# Altium schematic sheet Central PCB.SchDoc
size A
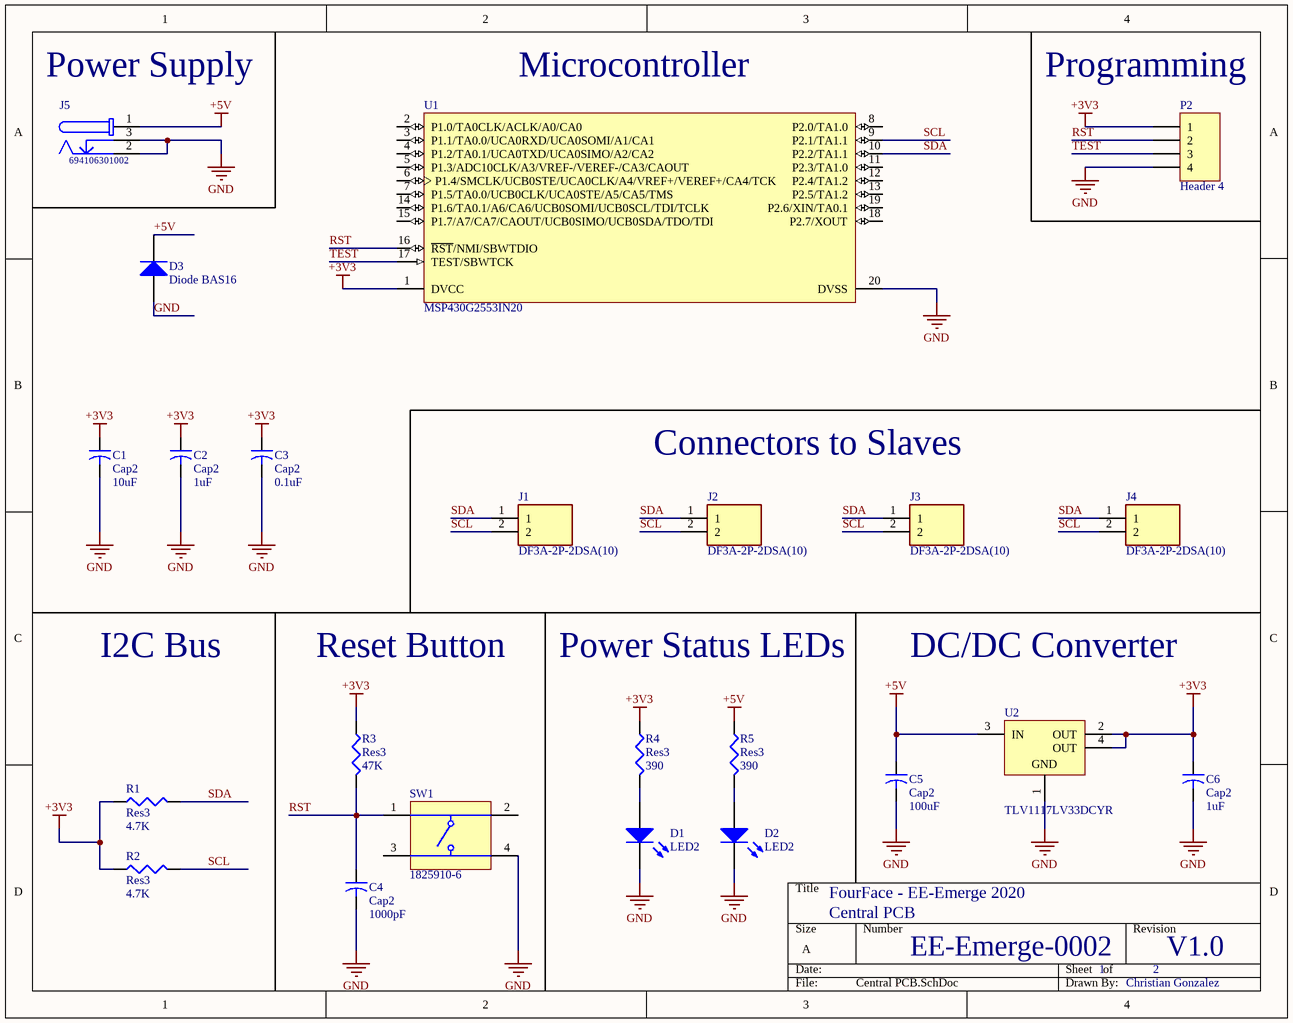
[diagram p0: Central PCB.SchDoc]

## Parts
C1  Cap2  value 10uF  [C0805]
C2  Cap2  value 1uF  [C0805]
C3  Cap2  value 0.1uF  [C0805]
C4  Cap2  value 1000pF  [C0805]
C5  Cap2  value 100uF  [C0805]
C6  Cap2  value 1uF  [C0805]
D1  LED2  [3.2X1.6X1.1]
D2  LED2  [3.2X1.6X1.1]
D3  Diode BAS16  [SOT-23_N]
J1  DF3A-2P-2DSA(10)  [SHDR2W50P0X200_1X2_600X500X500P]
J2  DF3A-2P-2DSA(10)  [SHDR2W50P0X200_1X2_600X500X500P]
J3  DF3A-2P-2DSA(10)  [SHDR2W50P0X200_1X2_600X500X500P]
J4  DF3A-2P-2DSA(10)  [SHDR2W50P0X200_1X2_600X500X500P]
J5  694106301002  [694106301002]
P2  Header 4  [HDR1X4]
R1  Res3  value 4.7K  [6-0805_N]
R2  Res3  value 4.7K  [6-0805_N]
R3  Res3  value 47K  [6-0805_N]
R4  Res3  value 390  [6-0805_N]
R5  Res3  value 390  [6-0805_N]
SW1  1825910-6  [TECO-1825910-6_V]
U1  MSP430G2553IN20  [N0020A]
U2  TLV1117LV33DCYR  [DCY0004A_N]

## Nets
+3V3: C1.1 C2.1 C3.1 C6.1 P2.1 R1.1 R2.1 R3.1 R4.1 U1.1(DVCC) U2.2(OUT) U2.4(OUT)
+5V: C5.1 D3.3(K) J5.1 R5.1 U2.3(IN)
GND: C1.2 C2.2 C3.2 C4.2 C5.2 C6.2 D1.2(K) D2.2(K) D3.1(A) J5.2 J5.3 P2.4 SW1.4 U1.20(DVSS) U2.1(GND)
RST: C4.1 P2.2 R3.2 SW1.1 U1.16(~{RST}/NMI/SBWTDIO)
SCL: J1.2 J2.2 J3.2 J4.2 R2.2 U1.9(P2.1/TA1.1)
SDA: J1.1 J2.1 J3.1 J4.1 R1.2 U1.10(P2.2/TA1.1)
TEST: P2.3 U1.17(TEST/SBWTCK)
NetD1_1: D1.1(A) R4.2
NetD2_1: D2.1(A) R5.2

Not connected (* = marked no-connect by the designer): SW1 2 3; U1 2(P1.0/TA0CLK/ACLK/A0/CA0) 3(P1.1/TA0.0/UCA0RXD/UCA0SOMI/A1/CA1) 4(P1.2/TA0.1/UCA0TXD/UCA0SIMO/A2/CA2) 5(P1.3/ADC10CLK/A3/VREF-/VEREF-/CA3/CAOUT) 6(P1.4/SMCLK/UCB0STE/UCA0CLK/A4/VREF+/VEREF+/CA4/TCK) 7(P1.5/TA0.0/UCB0CLK/UCA0STE/A5/CA5/TMS) 8(P2.0/TA1.0) 11(P2.3/TA1.0) 12(P2.4/TA1.2) 13(P2.5/TA1.2) 14(P1.6/TA0.1/A6/CA6/UCB0SOMI/UCB0SCL/TDI/TCLK) 15(P1.7/A7/CA7/CAOUT/UCB0SIMO/UCB0SDA/TDO/TDI) 18(P2.7/XOUT) 19(P2.6/XIN/TA0.1)

## Notes on the sheet
- (near J5) Power Supply
- (near U1) Microcontroller
- (near P2) Programming
- Connectors to Slaves
- I2C Bus
- Reset Button
- Power Status LEDs
- DC/DC Converter
- FourFace - EE-Emerge 2020
- Central PCB
- EE-Emerge-0002
- 1
- 2
- V1.0
- Christian Gonzalez

## Library data of the parts
C1 C3-C6 = Cap2: Capacitor; Published: 23-Sep-2002; PackageReference: CAPR5-4X5; Publisher: Altium Limited; PackageDescription: Capacitor; 2 Leads
C2 = Cap2_4: Capacitor; Published: 23-Sep-2002; PackageReference: CAPR5-4X5; Publisher: Altium Limited; PackageDescription: Capacitor; 2 Leads
D1 D2 = LED2: Typical RED, GREEN, YELLOW, AMBER GaAs LED; Published: 8-Jun-2000; LatestRevisionDate: 17-Jul-2002; LatestRevisionNote: Re-released for DXP Platform.; PackageVersion: Feb-2002; PackageReference: 3.2X1.6X1.1; Publisher: Altium Limited; PackageDescription: SM LED; 2 Flat Leads
D3 = Diode BAS16: Silicon Switching Diode for High-Speed Switching; Note: Pin 2 is not connected and not drawn.; Published: 21-Mar-2003; LatestRevisionDate: 29-May-2009; LatestRevisionNote: IPC-7351 Footprint Added.; DatasheetVersion: Oct-1999; PackageVersion: Sep-2001; PackageReference: SOT-23; Publisher: Altium Limited; PackageDescription: 3-Pin SOT-23 Package 0.95 mm Pitch, 2.5 mm Lead Span; ComponentLink1Description: Manufacturer Link; ComponentLink1URL: http://www.infineon.com/; ComponentLink2Description: Datasheet; ComponentLink2URL: http://www.infineon.com/upload/Document/cmc_upload/documents/012/5331/bas16series.pdf
J1-J4 = DF3A-2P-2DSA(10): Connector; Manufacturer_Name: Hirose; Datasheet Link: https://componentsearchengine.com/Datasheets/1/DF3A-2P-2DSA(10).pdf; Height: 5mm; Manufacturer_Part_Number: DF3A-2P-2DSA(10); Mouser Part Number: 798-DF3A-2P-2DSA10; Mouser Price/Stock: https://www.mouser.com/Search/Refine.aspx?Keyword=798-DF3A-2P-2DSA10
J5 = CMP-1502-00188-1: DC Power Jack Connector WR-DC, Male, Right Angled, THT, 5 A, 24 V; Manufacturer: Wurth Elektronik; Plug Inner Diameter: 2.05mm; Opening Diameter: 6.4mm; Rated Current: 5A; Plug Outer Diameter: 5.5mm; Working Voltage: 24V; Datasheet URL: http://katalog.we-online.de/em/datasheet/6941xx301002.pdf; Packaging: Bag; Manufacturer URL: http://www.we-online.de; Part Number: 694106301002; Gender: Male; Publisher: WurthElektronik; Operating Temperature: -40to85degC; Mounting Technology: THT; Package Reference: 694106301002; Orientation: RightAngled
P2 = Header 4: Header, 4-Pin; LatestRevisionDate: 17-Jul-2002; LatestRevisionNote: Re-released for DXP Platform.; Publisher: Altium Limited
R1-R5 = Res3: Resistor; Published: 8-Jun-2000; LatestRevisionDate: 29-May-2009; LatestRevisionNote: IPC-7351 Footprint Added.; PackageReference: J1-0603; Publisher: Altium Limited; PackageDescription: Chip Resistor
SW1 = CMP-1684-00021-1: Tact Switch, SPST-NO, 0.05 A, -35 to 85 degC, 4-Pin THD, RoHS, Bulk; Manufacturer: TE Connectivity; Maximum Contact Resistance: 100mOhm; Mechanical Life: 100000Cycles; Bushing Type: Unthreaded; Switch Configuration: OFF(ON); Maximum DC Voltage Rating: 24V; Contact Rating @ Voltage: 0.05A@24VDC; Actuator Color: Black; Body Orientation: Straight; Function: MomentaryContact; Illumination: N/R; Actuator Style: RoundButton; Actuator Material: PolybutyleneTerephthalate; Dielectric Strength: 500VAC; Pole Throw Configuration: SPST; Actuator Length: 1.4mm; Product Weight: N/A; Contact Material: CopperAlloy; Housing Material: N/A; Terminal Type: PCPins; Minimum Insulation Resistance: 100MOhm; Package Description: 4-Pin Through Hole Device, Body 5.99 x 5.99 mm, Pitch 6.5 mm; Part No: 1825910-6; Package Reference: THD; Base Material: N/A; Manufacturer URL: http://www.te.com; Contact Plating: Silver; RoHS: Yes; Datasheet Version: Rev. C9; Electrical Life: 100000Cycles; Maximum AC Voltage Rating: N/A; Thread Size: N/R; Operating Temperature: -35to85C; Mounting: ThroughHole; Dimension: 5.99x5mm; Datasheet URL: http://www.te.com/commerce/DocumentDelivery/DDEController?Action=showdoc&DocId=Customer+Drawing%7F1825910%7FC9%7Fpdf%7FEnglish%7FENG_CD_1825910_C9.pdf%7F1825910-6; Family: 1825910; Seal Location: N/A; Seal Description: N/A; Packaging: N/A
U1 = CMP-0365-00184-2: 16 MHz Mixed Signal Microcontroller with 16 KB Flash, 512 B SRAM and 24 GPIOs, -40 to 85 degC, 20-pin DIP (N), Pb-Free (RoHS); Manufacturer: Texas Instruments; USCI_B (I2C & SPI): 1; Temp Sensor: Yes; SubFamily: Value Line; Frequency(MHz): 16; ADC Channels: 8; SRAM(B): 512; ADC: 10-bit SAR; GPIO: 24; Timers - 16-bit: 2; Code_JEDEC: MS-001; Eco-Plan: Pb-Free (RoHS); PartNumber: MSP430G2553IN20; ComponentLink1URL: http://www.ti.com/; PackageVersion: 4040049/E; Comparators: Yes; Watchdog: Yes; ComponentLink2Description: Datasheet; ComponentLink1Description: Manufacturer URL; Mounting Technology: Through Hole; ComponentLink2URL: http://www.ti.com/general/docs/lit/getliterature.tsp?genericPartNumber=MSP430G2553&fileType=pdf; Brown Out Reset: Yes; PackageReference: N0020A; PackageDescription: 20-Pin Plastic In-Line, Body 25.40 x 6.35 mm, Pitch 2.54 mm; ComponentLink3URL: http://www.ti.com/litv/pdf/mpds177g; ComponentLink3Description: Package Specification; Flash(KB): 16; Cap touch I/O: Yes; USCI_A (UART/LIN/IrDA/SPI): 1; DatasheetVersion: SLAS735G; Manufacturer 1: Texas Instruments; Manufacturer Part Number 1: MSP430G2553IN20
U2 = CMP-0395-00503-2: Single Output LDO, 1 A, Fixed 3.3 V Output, 2 to 5.5 V Input, 4-pin SOT-223 (DCY), -40 to 125 degC, Green (RoHS & no Sb/Br); Manufacturer: Texas Instruments; Vout Adj(Min)(V): 3.3; Vdo(Typ)(mV): 1200; Iq(Typ)(mA): 0.05; Accuracy(%): 2; Iout(Max)(A): 1; SubFamily: Single Channel LDO; Vin(Max)(V): 5.5; PackageReference: DCY0004A; PackageDescription: 4-Pin Plastic Small Outline, Body 3.5 x 6.5 mm, Pitch 2.3 mm; Vout Adj(Max)(V): 3.3; Mounting Technology: Surface Mount; ComponentLink2Description: Datasheet; ComponentLink1Description: Manufacturer URL; PartNumber: TLV1117LV33DCYR; ComponentLink3Description: Package Specification; ComponentLink1URL: http://www.ti.com/; ComponentLink2URL: http://www.ti.com/general/docs/lit/getliterature.tsp?genericPartNumber=TLV1117LV33&fileType=pdf; Fixed Output Options(V): 3.3; PackageVersion: 4202506/B; Vin(Min)(V): 2; DatasheetVersion: SBVS160A; Eco-Plan: Green (RoHS & no Sb/Br); ComponentLink3URL: http://www.ti.com/litv/pdf/mpds094a; Code_JEDEC: TO-261